# EAGLE schematic TRV_ANAREN_V0.3 (EAGLE 6.3)
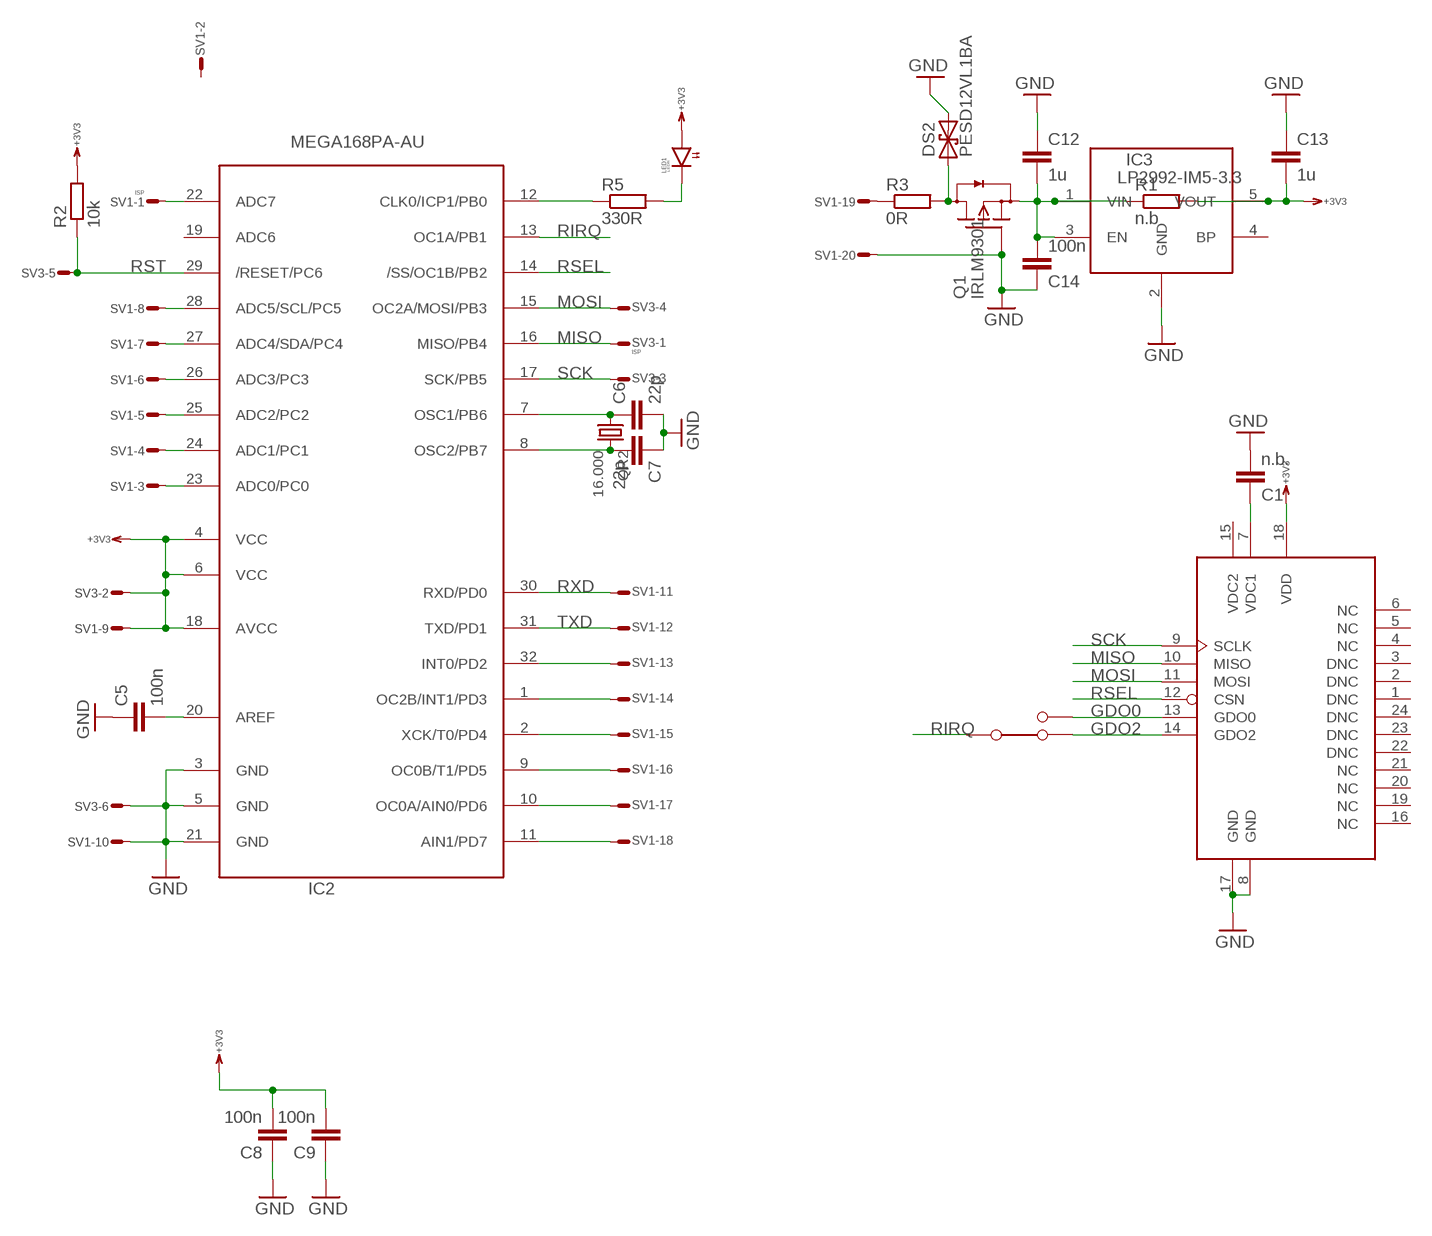
[diagram p0: schematic, sheet 1]

## Parts
BR1  BR  [BR]
C1  n.b.  C0603  [0603]
C5  100n  C0603  [0603]
C6  22p  C0603  [0603]
C7  22p  C0603  [0603]
C8  100n  C0603  [0603]
C9  100n  C0603  [0603]
C12  1u  C0603  [0603]
C13  1u  C0603  [0603]
C14  100n  C0603  [0603]
DS2  PESD12VL1BA  TVS-U323  [SOD323]
IC2  MEGA168PA-AU  MEGA168PA  [TQFP32-08]
IC3  LP2992-IM5-3.3  LDO  [SOT23-5]
LED1  LEDR  LED0603  [0603]
Q1  IRLM9301  FET-PDSOT23  [SOT23]
QR2  16.000  Q49UV  [HC49U-V]
R1  n.b  R0603  [0603]
R2  10k  R0603  [0603]
R3  0R  R0603  [0603]
R5  330R  R0603  [0603]
RF1  ANARENC  [ANAREN_C]
SV1  ISP  ML20E  [ML20]
SV3  ISP  ML6E  [ML6]

## Nets
+3V3: C8.2 C9.2 C13.2 IC2.4(VCC) IC2.6(VCC) IC2.18(AVCC) IC3.5(VOUT) LED1.1(A) R1.2 R2.2 RF1.18(VDD) SV1.9 SV3.2
GDO0: BR1.R RF1.13(GDO0)
GDO2: BR1.L RF1.14(GDO2)
GND: C1.2 C5.1 C6.2 C7.1 C8.1 C9.1 C12.1 C13.1 C14.1 DS2.C IC2.3(GND) IC2.5(GND) IC2.21(GND) IC3.2(GND) Q1.1(G) RF1.8(GND) RF1.17(GND) SV1.10 SV1.20 SV3.6
MISO: IC2.16(MISO/PB4) RF1.10(MISO) SV3.1
MOSI: IC2.15(OC2A/MOSI/PB3) RF1.11(MOSI) SV3.4
N$1: IC2.12(CLK0/ICP1/PB0) R5.1
N$2: C1.1 RF1.7(VDC1)
N$3: IC2.22(ADC7) SV1.1
N$5: DS2.A Q1.3(D) R3.2
N$6: C5.2 IC2.20(AREF)
N$12: C12.2 C14.2 IC3.1(VIN) IC3.3(EN) Q1.2(S) R1.1
N$18: C6.1 IC2.7(OSC1/PB6) QR2.1
N$19: C7.2 IC2.8(OSC2/PB7) QR2.2
N$21: LED1.2(C) R5.2
N$23: R3.1 SV1.19
PC0: IC2.23(ADC0/PC0) SV1.3
PC1: IC2.24(ADC1/PC1) SV1.4
PC2: IC2.25(ADC2/PC2) SV1.5
PC3: IC2.26(ADC3/PC3) SV1.6
PC4: IC2.27(ADC4/SDA/PC4) SV1.7
PC5: IC2.28(ADC5/SCL/PC5) SV1.8
PD2: IC2.32(INT0/PD2) SV1.13
PD3: IC2.1(OC2B/INT1/PD3) SV1.14
PD4: IC2.2(XCK/T0/PD4) SV1.15
PD5: IC2.9(OC0B/T1/PD5) SV1.16
PD6: IC2.10(OC0A/AIN0/PD6) SV1.17
PD7: IC2.11(AIN1/PD7) SV1.18
RIRQ: BR1.M IC2.13(OC1A/PB1)
RSEL: IC2.14(/SS/OC1B/PB2) RF1.12(CSN)
RST: IC2.29(/RESET/PC6) R2.1 SV3.5
RXD: IC2.30(RXD/PD0) SV1.11
SCK: IC2.17(SCK/PB5) RF1.9(SCLK) SV3.3
TXD: IC2.31(TXD/PD1) SV1.12
Unconnected: IC2.19(ADC6) IC3.4(BP) RF1.1(DNC) RF1.2(DNC) RF1.3(DNC) RF1.4(NC) RF1.5(NC) RF1.6(NC) RF1.15(VDC2) RF1.16(NC) RF1.19(NC) RF1.20(NC) RF1.21(NC) RF1.22(DNC) RF1.23(DNC) RF1.24(DNC) SV1.2

## Library data of the parts
BR1 = Conn:BR
C1 C5-C9 C12-C14 = RCL:C: Capacitor SMD
DS2 = Diode:TVS-U: DIODE
IC2 = atmel:MEGA168P: MCU, 4/8/16k, TQFP32
IC3 = DCDC:LDO
LED1 = Optic:LED
Q1 = Transistor:FET-PD
QR2 = QUARTZ:Q
R1-R3 R5 = RCL:R: Resistor SMD
RF1 = RF:ANAREN
SV1 = Conn:ML20?E: HARTING
SV3 = Conn:ML6E: HARTING